# Altium project PCB_Project_2.PrjPcb
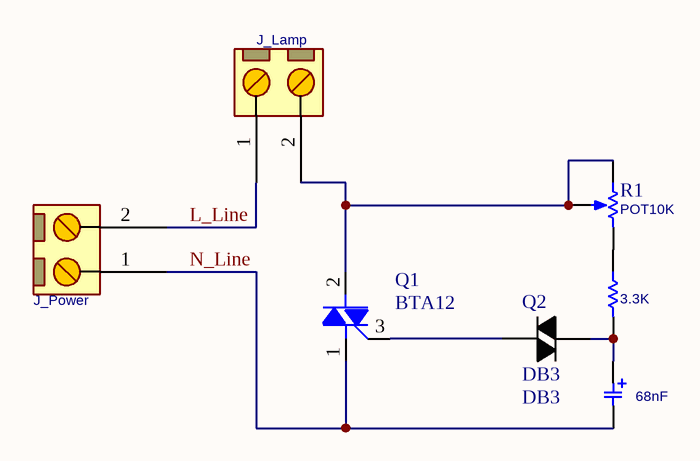
[diagram p0: Sheet1.SchDoc]
1 sheet, 7 parts. Net scope: global (net labels, ports and power ports of the same name join across sheets).
Board file: PCB1.PcbDoc

## Sheet Sheet1.SchDoc
size A4; SheetNumber: 1; SheetTotal: 1

### Parts
J_Lamp  CONN_TB2  [MSTB_2]  (value not drawn)
J_Power  CONN_TB2  [MSTB_2]  (value not drawn)
Q1  BTA12  [TO220_3]
Q2  DB3  [D_AX03_DO35]
R1  POT10K  [VOL_R]
  68nF  [C_FLM_7X5H11]
  3.3K  [R025W_AX04]

### Nets
L_Line: J_Lamp.1 J_Power.2
N_Line: J_Power.1 Q1.1(T1) .2
NetJ_Lamp_2: J_Lamp.2 Q1.2(T2) R1.1(TOP) R1.2(TAP)
NetQ1_3: Q1.3(G) Q2.2(A2)
NetQ2_1: Q2.1(A1) .1 .2
NetR1_3: R1.3(BOT) .1

### Library data of the parts
J_Lamp J_Power = CONN_MSTB_2: CONN, PHOENIX MSTB, 5-G, 5.08mm pitch; PARAM2: 320V; PARAM: 12A; VALUE: CONN_TB2
Q1 = TRIAC_BTA12-600_TO220: Triac, 600V, 12A, TO-220; MANF_P#: BTA12-600BW, BTA12-600CW, BTA12-600TW; MANF: ST; PRICE: 1200toman@PAYA; VALUE: BTA12
Q2 = DIAC_DB3_DO35: Diac, 32VBO, DO-35; MANF: ST; PARAM: 2A, -40~125oC; MANF_P#: DB3; PRICE: toman@PAYA; PARAM2: 32VBO; VALUE: DB3
R1 = RES_THD_POT_VOLUME: RESISTOR, THD, Potentiometer Volume; VALUE: POT10K
 = CAP_THD_FLM: CAP, THD, FILM,; MANF_P#: MANF_PART#; PARAM2: 25V; DESC: DESCRIPTION; DIST#: MOUSER; PARAM: 20%
 = RES_THD: RESISTOR, THD; MANF_P#: RK73H1ETTP4701F; MANF: KOA SPEER; PARAM: 0.063W; DESC: DESCRIPTION; DIST#: MOUSER; PARAM2: 1%; ASSEMBLY: ASSEMBLY; PRICE: 100= 0.5$; VALUE: 3.3K